# Altium schematic sheet SC941C_Variateurs.SchDoc: Variateurs
size 393 x 270 mm; CompanyName: Seccom; Address1: 521, rue du capt. François Garbit; Address2: 69440 Mornant; Address3: seccom@seccom.fr; Address4: www.seccom.fr; DocumentNumber: 7; SheetNumber: 7; SheetTotal: 9; PageSetup: Record=PageOptions|CenterHorizontal=True|CenterVertical=True|PrintScale=0.74|XCorrection=1.00|YCorrection=1.00|PrintKind=0|BorderSize=5000000|LeftOffset=0|BottomOffset=0|Orientation=2|PaperLength=1000|PaperWidth=1000|Scale=100|PaperSource=7|PrintQuality=-4|MediaType=1|DitherType=10|PaperKind=A4|PrintScaleMode=1
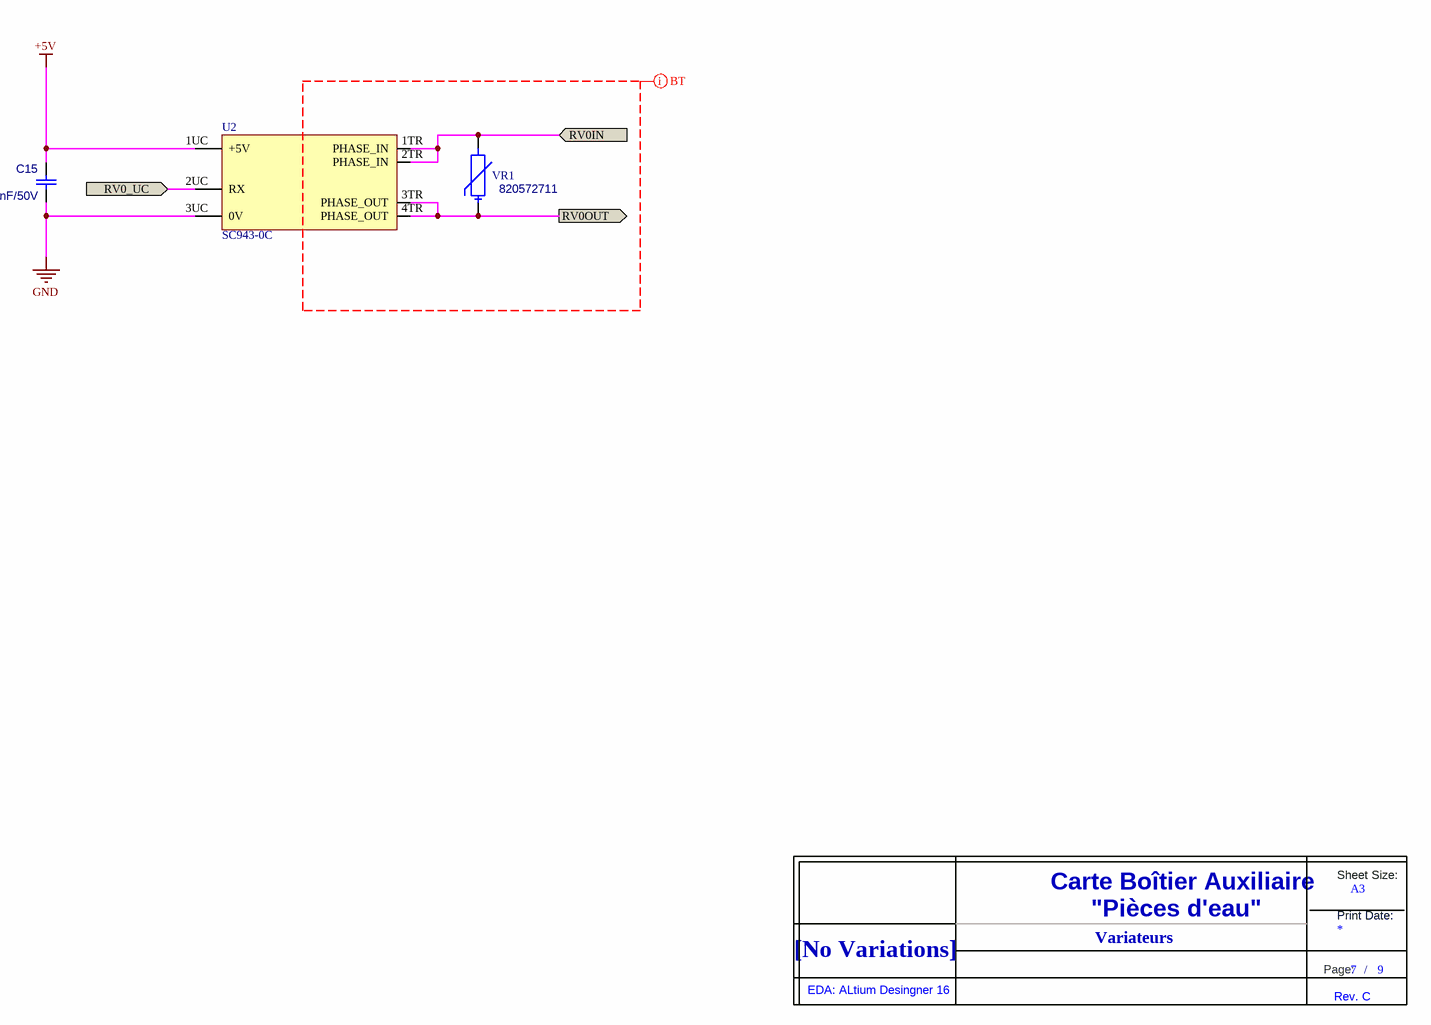
[diagram p0: SC941C_Variateurs.SchDoc]

## Parts
C15  value 100nF/50V  [0805_ReflowSoldering_CAP]  (hidden comment: C_0805_X7R_10%_100N-50V)
Title_new  DNI  (value not drawn)  (graphical)
U2  SC943-0C  [SI943C_REV_A]
VR1  value 820572711  [VDR_Serie_820_d7_h13_e5mm]  (hidden comment: VDR_820572711)

## Ports
RV0_UC (in), RV0IN (in), RV0OUT (out)

## Nets
+5V: C15.1 U2.1UC(+5V)
GND: C15.2 U2.3UC(0V)
RV0_UC: U2.2UC(RX) ; port RV0_UC
RV0IN: U2.1TR(PHASE_IN) U2.2TR(PHASE_IN) VR1.2 ; port RV0IN
RV0OUT: U2.3TR(PHASE_OUT) U2.4TR(PHASE_OUT) VR1.1 ; port RV0OUT

## Layout directives
net class BT: (no net found under the mark)

## Notes on the sheet
- Variateurs
- (in symbol Title_new) Sheet Size:; Carte Boîtier Auxiliaire; A3; "Pièces d'eau"; Print Date:; [No Variations]; Page:; /; EDA: ALtium Desingner 16; Rev. C

## Library data of the parts
C15 = C_0805_X7R_10%_100N-50V: Condensateur céramique, X7R, 10%, CMS 0805; Creation: LJ; Verification: LJ (28/05/04); Reference: 000042/00; Boitier: 0805; Remarque: {Remarque}; Fabricant: AVX; Ref Fab: 08055C104KAT2A; Coeff: 1; ComponentLink1URL: o:\_Documentation\Datasheets\BC_Components\Condo_CMS_NPO-X7R-Y5V.pdf; ComponentLink2URL: o:\_Documentation\Datasheets\_BOITIERS\PASSIF_CMS\RC_0805_(2x1,25)_(Schneider).PDF; Config: *; ComponentLink1Description: Datasheet; ComponentLink2Description: Datasheet Boitier; Supplier 1: Farnell; Supplier Part Number 1: 499687
Title_new = Title_new
U2 = SC943-0C: Carte gradateur; Boitier: SI943C; Coeff: 1; Fabricant: Valentinéa; Remarque: {Remarque}; Ref Fab: SC943-0C; Value: SC943-0C
VR1 = VDR_820572711: Varistance disque 275Vac, 350Vdc, 33J, Vbreak=430V@1mA, Vclamp=710V@10A, Ipeak=1200A; Creation: LJ (12/01/12); Reference: {Reference}; Boitier: d7_t4.6_h13_e5mm; Remarque: {Remarque}; Fabricant: Wurth Elektronik; Coeff: 1; Ref Fab: 820572711; ComponentLink1URL: o:\_Documentation\Datasheets\Wurth_Elektronik\Varistance_820572711.pdf; ComponentLink2URL: o:\_Documentation\Datasheets\; Config: *; ComponentLink1Description: Datasheet; ComponentLink2Description: Datasheet Boitier